# Altium schematic sheet Sheet1.SchDoc
size A4; SheetNumber: 1; SheetTotal: 1
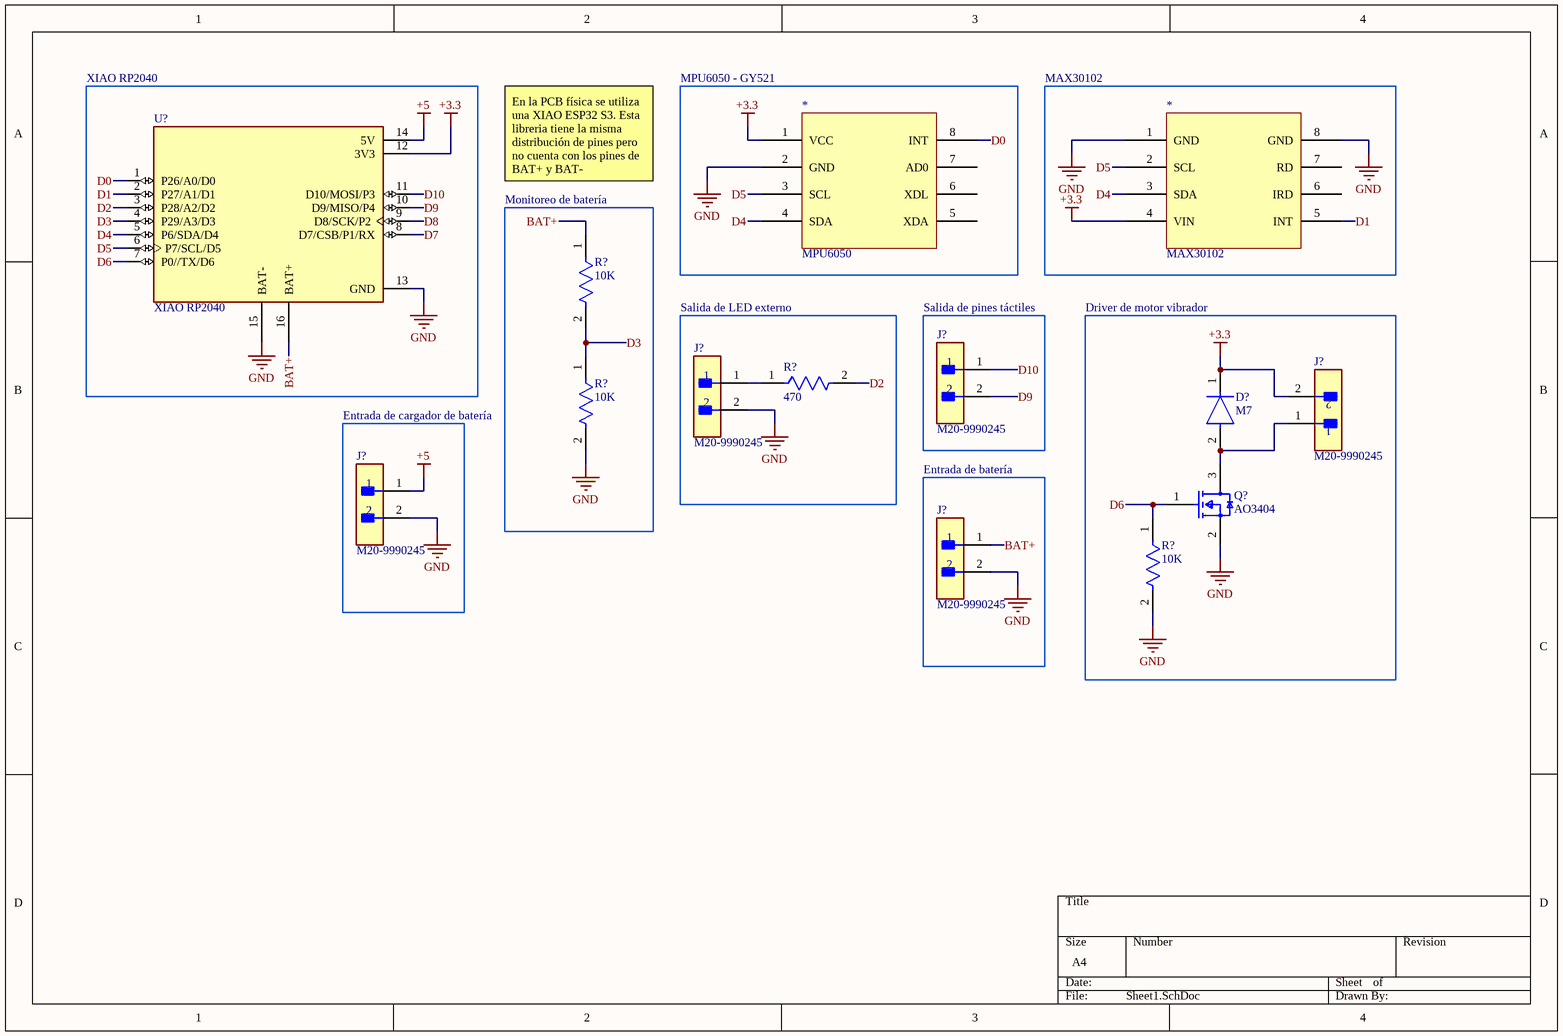
[diagram p0: Sheet1.SchDoc]

## Parts
(Parts that share a designator on the sheet are numbered #1, #2 ... from top to bottom, then left to right.)
*#1  MPU6050  [PCBComponent_1]
*#2  MAX30102  [PCBComponent_1]
D?  M7  [FP-403AE-MFG]
J?#1  M20-9990245  [FP-M20-9990245-MFG]
J?#2  M20-9990245  [FP-M20-9990245-MFG]
J?#3  M20-9990245  [FP-M20-9990245-MFG]
J?#4  M20-9990245  [FP-M20-9990245-MFG]
J?#5  M20-9990245  [FP-M20-9990245-MFG]
Q?  AO3404  [FP-318-08-IPC_B]
R?#1  10K  [FP-RG2012-IPC_B]
R?#2  10K  [FP-RG2012-IPC_B]
R?#3  470  [FP-RG2012-IPC_B]
R?#4  10K  [FP-RG2012-IPC_B]
U?  XIAO RP2040  [MODULE_102010428]

## Blocks framed on the sheet
XIAO RP2040: U?
MPU6050 - GY521: *#1
MAX30102: *#2
Monitoreo de batería: R?#1 R?#2
Salida de LED externo: J?#2 R?#3
Salida de pines táctiles: J?#1
Driver de motor vibrador: D? J?#3 Q? R?#4
Entrada de cargador de batería: J?#4
Entrada de batería: J?#5

## Nets
+3.3: *#1.1(VCC) *#2.4(VIN) D?.1(C) J?#3.2 U?.12(3V3)
+5: J?#4.1 U?.14(5V)
GND: *#1.2(GND) *#2.1(GND) *#2.8(GND) J?#2.2 J?#4.2 J?#5.2 Q?.2(S) R?#2.2 R?#4.2 U?.13(GND) U?.15(BAT-)
BAT+: J?#5.1 R?#1.1 U?.16(BAT+)
D0: *#1.8(INT) U?.1(P26/A0/D0)
D1: *#2.5(INT) U?.2(P27/A1/D1)
D2: R?#3.2 U?.3(P28/A2/D2)
D3: R?#1.2 R?#2.1 U?.4(P29/A3/D3)
D4: *#1.4(SDA) *#2.3(SDA) U?.5(P6/SDA/D4)
D5: *#1.3(SCL) *#2.2(SCL) U?.6(P7/SCL/D5)
D6: Q?.1(G) R?#4.1 U?.7(P0//TX/D6)
D7: U?.8(D7/CSB/P1/RX)
D8: U?.9(D8/SCK/P2)
D9: J?#1.2 U?.10(D9/MISO/P4)
D10: J?#1.1 U?.11(D10/MOSI/P3)
NetD?_2: D?.2(A) J?#3.1 Q?.3(D)
NetJ?#2_1: J?#2.1 R?#3.1

Not connected (* = marked no-connect by the designer): *#1 5(XDA) 6(XDL) 7(AD0); *#2 6(IRD) 7(RD)

## Notes on the sheet
- En la PCB física se utiliza una XIAO ESP32 S3. Esta libreria tiene la misma distribución de pines pero no cuenta con los pines de BAT+ y BAT-

## Library data of the parts
*#1 *#2 = Component_1
D? = CMP-00278-84324859-1: ES1H Rectifier Diode, 1 Phase, 1 Element, 1A, 500V V(RRM), Silicon, DO-214AC; Manufacturer Lifecycle Status: ACTIVE, NOT REC; Recovery Time: 35ns; Forward Voltage: 1.7V; Peak Non-Repetitive Surge Current: 30A; Element Configuration: Single; Capacitance: 8pF; Max Junction Temperature (Tj): 150°C; Peak Reverse Current: 5µA; Forward Current: 1A; Reverse Recovery Time: 35ns; Weight: 106mg; REACH SVHC: No SVHC; Case/Package: SMA; RoHS: Compliant; Mount: Surface Mount; Max Forward Surge Current (Ifsm): 30A; NexarPartId: 84324859; Reverse Voltage: 500V; Radiation Hardening: No; Max Reverse Voltage (DC): 500V; Max Repetitive Reverse Voltage (Vrrm): 500V; Termination: SMD/SMT; Packaging: Cut Tape; Width: 2.896mm; Min Operating Temperature: -55°C; Schedule B: 8541100080, 8541100080; Number of Pins: 2; Height: 2.235mm; Contact Plating: Tin; Max Surge Current: 30A; Lifecycle Status: NRND; Max Operating Temperature: 150°C; Lead Free: Lead Free; Length: 4.6mm; Average Rectified Current: 1A
J?#1-J?#5 = CMP-15831-000105-1: CONN HEADER VERT 2POS 2.54MM; Working Voltage: 750V; Gender: Male; Number of Poles: 2; Current Rating: 3A; Mated Stacking Heights: 16.54mm; Contact Resistance: 25mR; Connector Type: Male Pin; Insulation Resistance: 10GR; Mating Cycles: 300; Voltage: 50V; Flammability Rating: UL94 V-0; Pitch: 2.54mm; Series: M20; Number of Contacts: 2; Height: 0.12inch; Min Operating Temperature: -40°C; Contact Finish - Mating: GOLD; Number of Positions: 2; Number of Rows: 1; Packaging: Bulk; Package Quantity: 1000; Voltage Rating (AC): 750V; Current: 3A; Mount: Through Hole; Case/Package: SIL; Orientation: Straight; Contact Shape: Square; Weight: 0.25lb; Radiation Hardening: No; Fastening Type: Pull; Length: 5.08mm; Depth: 2.54mm; Contact Mating Length: 0.24inch; Housing Material: Nylon; Reach SVHC Compliant: Yes; Insulation Material: Nylon; Color: Black; Width: 0.25inch; Insulation Color: Black; Contact Material: Brass; Contact Type: Male Pin; Termination: Solder; Max Operating Temperature: 105°C; Contact Plating: Gold; Housing Color: Black; Max Current Rating: 3A; Lead Pitch: 2.54mm
Q? = CMP-07173-000101-1: MOSFET N-CH 50V 220MA SOT-23; Turn-Off Delay Time: 20ns; Element Configuration: Single; Rds On Max: 3.5R; Gate to Source Voltage (Vgs): 20V; Threshold Voltage: 1.3V; Number of Elements: 1; Power Dissipation: 360mW; Rise Time: 9ns; Turn-On Delay Time: 2.5ns; Input Capacitance: 27pF; On-State Resistance: 6R; Lead Free: Lead Free; Length: 2.92mm; Width: 1.3mm; Drain to Source Breakdown Voltage: 50V; Min Operating Temperature: -55°C; REACH SVHC: No SVHC; Packaging: Tape and Reel; Radiation Hardening: No; Height: 0.93mm; Drain to Source Voltage (Vdss): 50V; Current Rating: 220mA; Voltage Rating (DC): 50V; Weight: 0.03g; Continuous Drain Current (ID): 220mA; Number of Pins: 3; Nominal Vgs: 1.3V; Max Power Dissipation: 360mW; Fall Time: 9ns; Drain to Source Resistance: 3.5R; Contact Plating: Tin; Case/Package: SOT-23; Package Quantity: 1; Dual Supply Voltage: 50V; Mount: Surface Mount; Termination: SMD/SMT; Max Operating Temperature: 150°C
R?#1-R?#4 = CMP-28537-010674-1: Automotive Metal Thin Film Chip Resistor, 0805, 470Ω, 0.1%, 25ppm/°C, 0.125W, 150V; Power Rating: 125mW; Resistance: 470R; Min Operating Temperature: -55°C; Voltage Rating: 150V; Length: 2mm; Features: Automotive AEC-Q200; Max Operating Temperature: 155°C; Weight: 0.000194oz; Series: RG; Case Code (Metric): 2012; Max Power Dissipation: 125mW; Height: 0.4mm; Case Code (Imperial): 0805; Tolerance: 0.1%; Lead Free: Lead Free; Voltage Rating (DC): 150V; Temperature Coefficient: 25ppm/°C; Packaging: Tape and Reel; Termination: SMD/SMT; Number of Terminations: 2; Case/Package: 0805; Resistor Type: Thin Film; RoHS Compliant: Yes; Width: 1.2mm
U? = 102010428: RP2040 XIAO RP2040 series ARMÂ® CortexÂ®-M0+ MCU 32-Bit Embedded Evaluation Board; MF: Seeed Technology Co., Ltd; SnapEDA_Link: https://www.snapeda.com/parts/102010428/Seeed+Technology+Co.%252C+Ltd/view-part/?ref=snap; Package: None; Value: *; MP: 102010428; Check_prices: https://www.snapeda.com/parts/102010428/Seeed+Technology+Co.%252C+Ltd/view-part/?ref=eda